# EAGLE schematic digitalLatchShield32 (EAGLE 7.3.0)
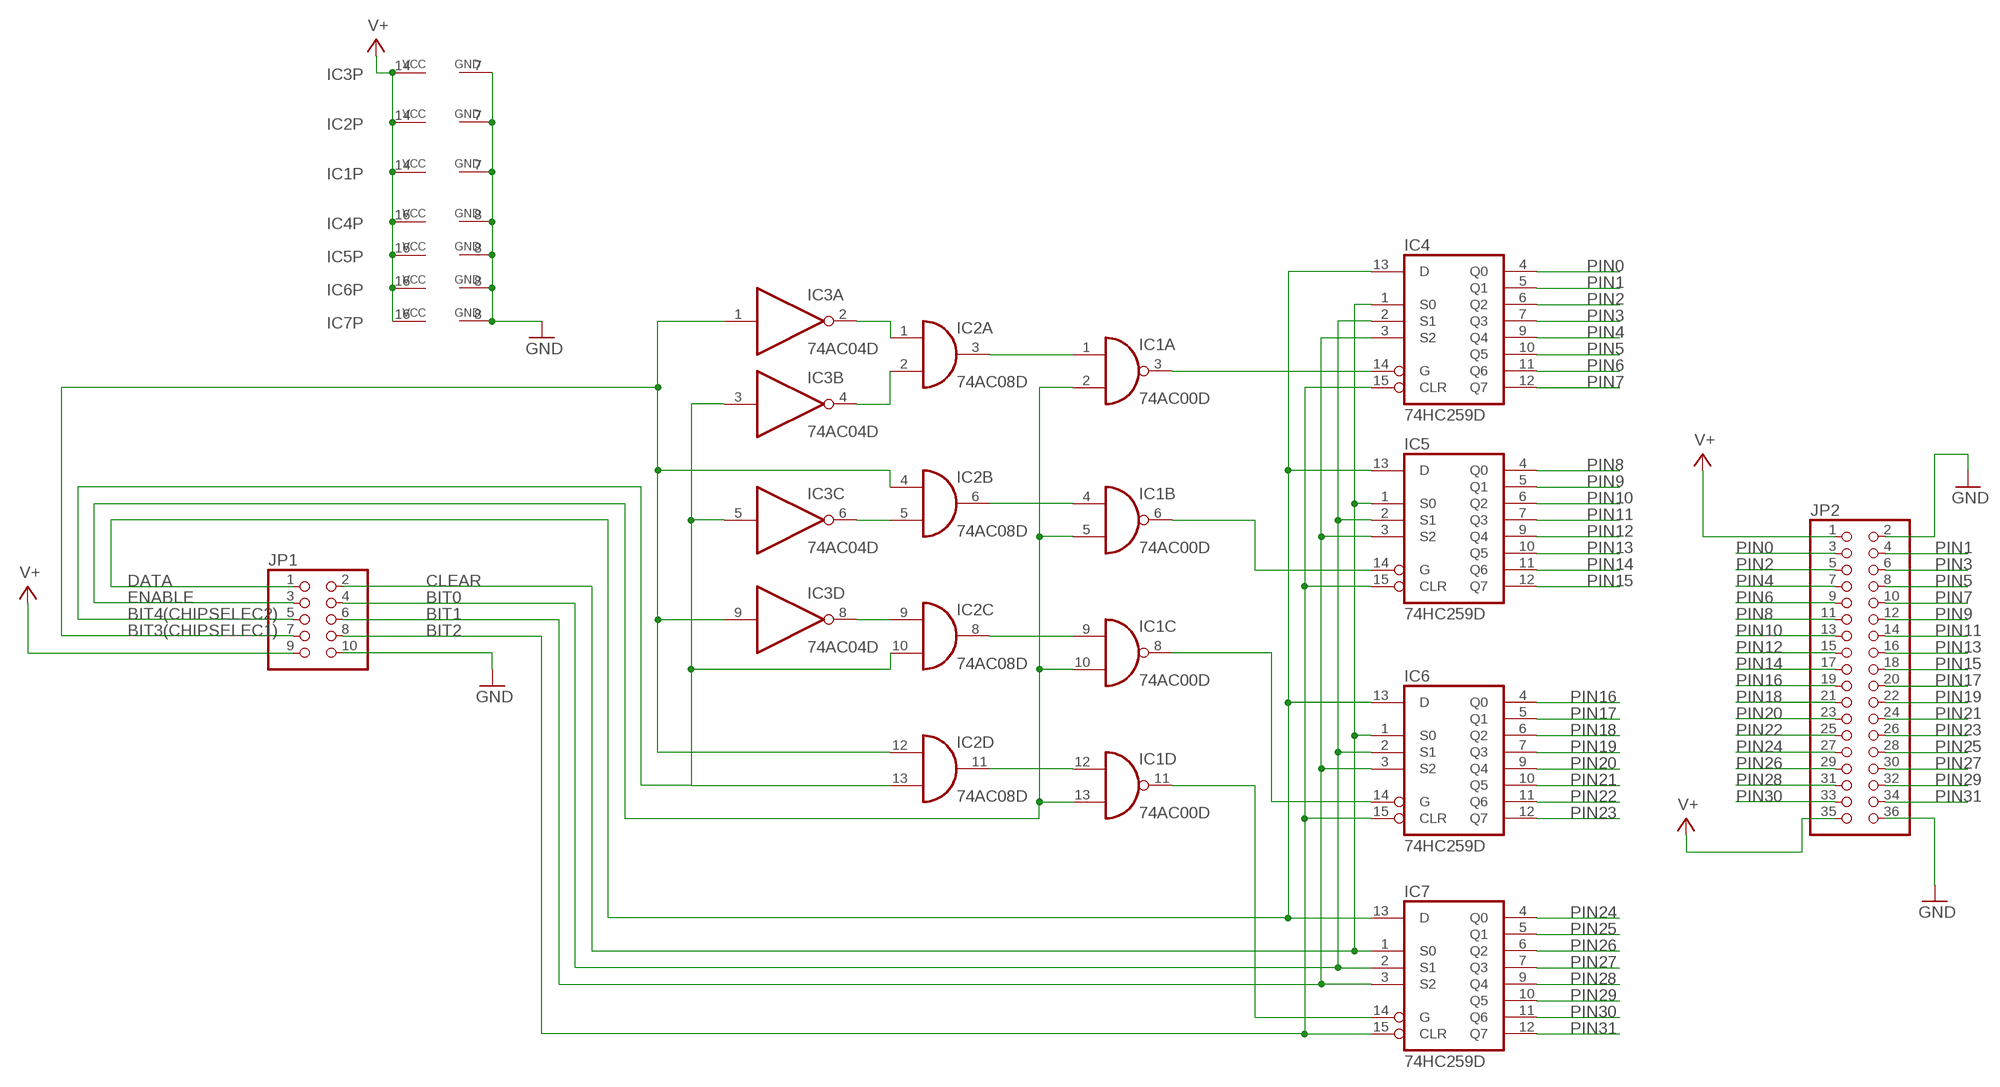
[diagram p0: schematic, sheet 1]

## Parts
IC1  74AC00D  [SO14]
IC2  74AC08D  [SO14]
IC3  74AC04D  [SO14]
IC4  74HC259D  [SO16]
IC5  74HC259D  [SO16]
IC6  74HC259D  [SO16]
IC7  74HC259D  [SO16]
JP1  PINHD-2X5  [2X05]
JP2  PINHD-2X18  [2X18]

## Nets
BIT0: IC4.2(S1) IC5.2(S1) IC6.2(S1) IC7.2(S1) JP1.4
BIT1: IC4.3(S2) IC5.3(S2) IC6.3(S2) IC7.3(S2) JP1.6
BIT2: IC4.15(CLR) IC5.15(CLR) IC6.15(CLR) IC7.15(CLR) JP1.8
BIT3(CHIPSELEC1): IC2.4(B:I0) IC2.12(D:I0) IC3.1(A:I) IC3.9(D:I) JP1.7
BIT4(CHIPSELEC2): JP1.5
CLEAR: IC4.1(S0) IC5.1(S0) IC6.1(S0) IC7.1(S0) JP1.2
DATA: IC4.13(D) IC5.13(D) IC6.13(D) IC7.13(D) JP1.1
ENABLE: IC1.2(A:I1) IC1.5(B:I1) IC1.10(C:I1) IC1.13(D:I1) JP1.3
GND: IC1.7(P:GND) IC2.7(P:GND) IC3.7(P:GND) IC4.8(GND) IC5.8(GND) IC6.8(GND) IC7.8(GND) JP1.10 JP2.2 JP2.36
N$1: IC1.1(A:I0) IC2.3(A:O)
N$2: IC1.4(B:I0) IC2.6(B:O)
N$3: IC1.9(C:I0) IC2.8(C:O)
N$4: IC1.12(D:I0) IC2.11(D:O)
N$6: IC2.1(A:I0) IC3.2(A:O)
N$7: IC2.2(A:I1) IC3.4(B:O)
N$8: IC2.5(B:I1) IC3.6(C:O)
N$9: IC2.10(C:I1) IC2.13(D:I1) IC3.3(B:I) IC3.5(C:I)
N$11: IC2.9(C:I0) IC3.8(D:O)
N$12: IC1.3(A:O) IC4.14(G)
N$13: IC1.6(B:O) IC5.14(G)
N$14: IC1.8(C:O) IC6.14(G)
N$15: IC1.11(D:O) IC7.14(G)
PIN0: IC4.4(Q0) JP2.3
PIN1: IC4.5(Q1) JP2.4
PIN2: IC4.6(Q2) JP2.5
PIN3: IC4.7(Q3) JP2.6
PIN4: IC4.9(Q4) JP2.7
PIN5: IC4.10(Q5) JP2.8
PIN6: IC4.11(Q6) JP2.9
PIN7: IC4.12(Q7) JP2.10
PIN8: IC5.4(Q0) JP2.11
PIN9: IC5.5(Q1) JP2.12
PIN10: IC5.6(Q2) JP2.13
PIN11: IC5.7(Q3) JP2.14
PIN12: IC5.9(Q4) JP2.15
PIN13: IC5.10(Q5) JP2.16
PIN14: IC5.11(Q6) JP2.17
PIN15: IC5.12(Q7) JP2.18
PIN16: IC6.4(Q0) JP2.19
PIN17: IC6.5(Q1) JP2.20
PIN18: IC6.6(Q2) JP2.21
PIN19: IC6.7(Q3) JP2.22
PIN20: IC6.9(Q4) JP2.23
PIN21: IC6.10(Q5) JP2.24
PIN22: IC6.11(Q6) JP2.25
PIN23: IC6.12(Q7) JP2.26
PIN24: IC7.4(Q0) JP2.27
PIN25: IC7.5(Q1) JP2.28
PIN26: IC7.6(Q2) JP2.29
PIN27: IC7.7(Q3) JP2.30
PIN28: IC7.9(Q4) JP2.31
PIN29: IC7.10(Q5) JP2.32
PIN30: IC7.11(Q6) JP2.33
PIN31: IC7.12(Q7) JP2.34
V+: IC1.14(P:VCC) IC2.14(P:VCC) IC3.14(P:VCC) IC4.16(VCC) IC5.16(VCC) IC6.16(VCC) IC7.16(VCC) JP1.9 JP2.1 JP2.35
Unconnected: IC3.10(E:O) IC3.11(E:I) IC3.12(F:O) IC3.13(F:I)

## Library data of the parts
IC1 = 74xx-eu:74*00: Quad 2-input NAND gate
IC2 = 74xx-eu:74*08: Quad 2-input AND gate
IC3 = 74xx-eu:74*04: Hex INVERTER
IC4-IC7 = 74xx-eu:74*259: 8-bit addressable LATCH
JP1 = pinhead:PINHD-2X5: PIN HEADER
JP2 = pinhead:PINHD-2X18: PIN HEADER